# EAGLE schematic LocoNet pca9685 (EAGLE 7.5.0)
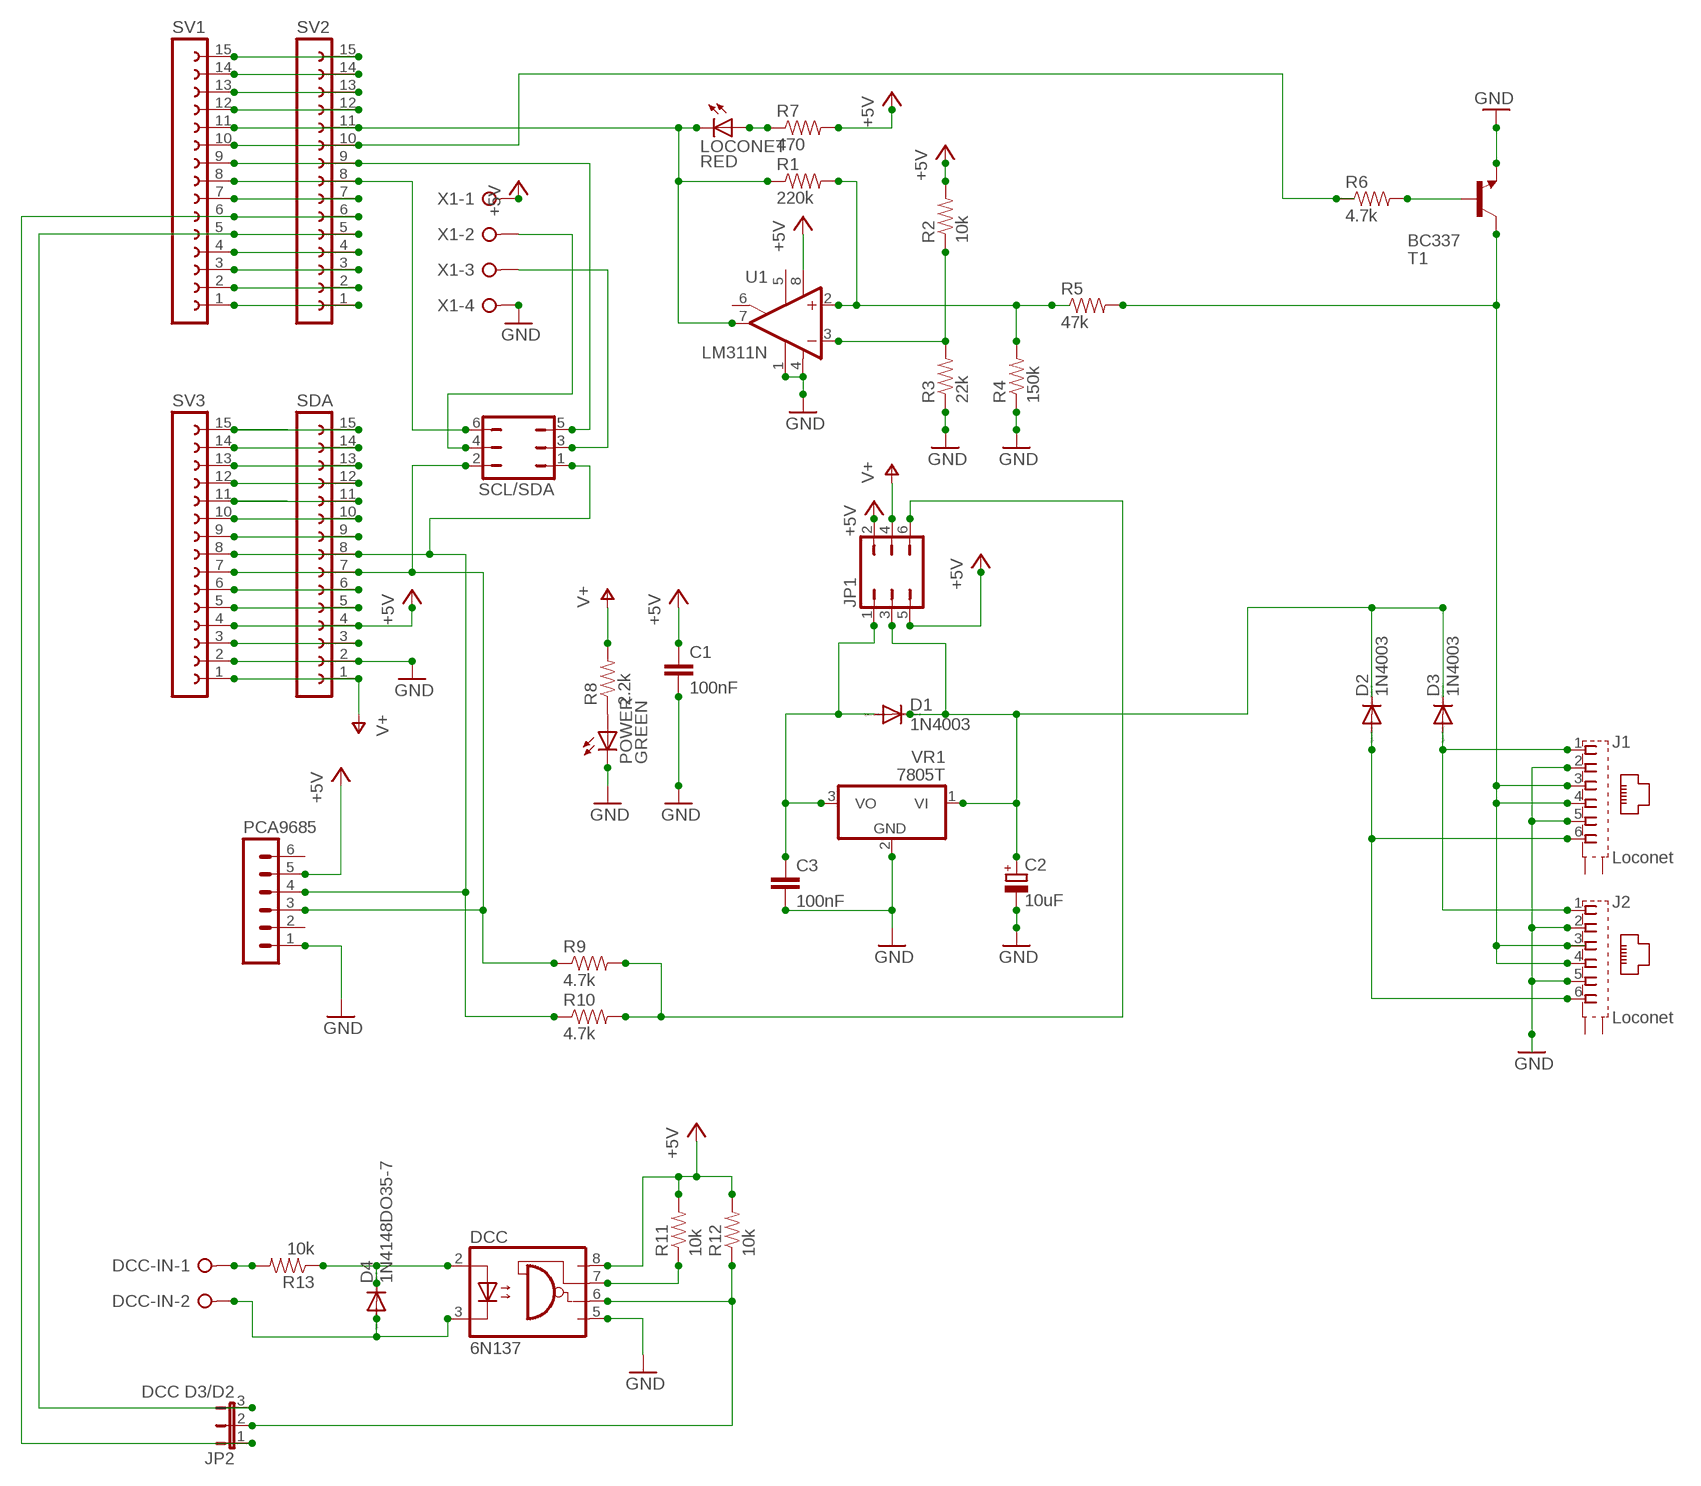
[diagram p0: schematic, sheet 1]

## Parts
C1  100nF  C-EU025_050-025X075  [C025_050-025X075]
C2  10uF  CPOL-EUE2.5-6  [E2,5-6]
C3  100nF  C-EU025_050-025X075  [C025_050-025X075]
D1  1N4003  1N4004  [DO41-10]
D2  1N4003  1N4004  [DO41-10]
D3  1N4003  1N4004  [DO41-10]
D4  1N4148DO35-7  [DO35-7]
DCC  6N137  [DIL08]
DCC-IN  W237-02P  [W237-132]
J1  Loconet  555140-1  [555140-1]
J2  Loconet  555140-1  [555140-1]
JP1  JP3Q  [JP3Q]
JP2  DCC D3/D2  JP2E  [JP2]
LOCONET  RED  LED3MM  [LED3MM]
PCA9685  MA06-1  [MA06-1]
POWER  GREEN  LED3MM  [LED3MM]
R1  220k  RESISTORAXIAL-0.3  [AXIAL-0.3]
R2  10k  RESISTORAXIAL-0.3  [AXIAL-0.3]
R3  22k  RESISTORAXIAL-0.3  [AXIAL-0.3]
R4  150k  RESISTORAXIAL-0.3  [AXIAL-0.3]
R5  47k  RESISTORAXIAL-0.3  [AXIAL-0.3]
R6  4.7k  RESISTORAXIAL-0.3  [AXIAL-0.3]
R7  470  RESISTORAXIAL-0.3  [AXIAL-0.3]
R8  2.2k  RESISTORAXIAL-0.3  [AXIAL-0.3]
R9  4.7k  RESISTORAXIAL-0.3  [AXIAL-0.3]
R10  4.7k  RESISTORAXIAL-0.3  [AXIAL-0.3]
R11  10k  RESISTORAXIAL-0.3  [AXIAL-0.3]
R12  10k  RESISTORAXIAL-0.3  [AXIAL-0.3]
R13  10k  RESISTORAXIAL-0.3  [AXIAL-0.3]
SCL/SDA  JP3Q  [JP3Q]
SDA  FE15-1NOTEXT  [FE15]
SV1  FE15-1NOTEXT  [FE15]
SV2  FE15-1NOTEXT  [FE15]
SV3  FE15-1NOTEXT  [FE15]
T1  BC337  [TO92]
U1  LM311N  [DIL08]
VR1  7805T  [TO220H]
X1  W237-04P  [W237-4P]

## Nets
+5V [5v]: C1.1 DCC.8(VCC) JP1.2 JP1.5 PCA9685.5 R2.P$2 R7.P$2 R11.P$2 R12.P$2 SDA.4 SV3.4 U1.8(V+) X1.1
ARDUINO-DCC: DCC.6(VO) JP2.2 R12.P$1
GND [ground]: C1.2 C2.- C3.2 DCC.5(GND) J1.2 J1.5 J2.2 J2.5 PCA9685.1 POWER.K(C) R3.P$1 R4.P$1 SDA.2 SV3.2 T1.1(E) U1.1(GND) U1.4(V-) VR1.2(GND) X1.4
L-RX: LOCONET.K(C) R1.P$1 SV1.11 SV2.11 U1.7(OUT)
L-TX: R6.P$1 SV1.10 SV2.10
N$1 [Vin]: D3.A J1.1 J2.1
N$2 [Vin]: D2.A J1.6 J2.6
N$3: JP1.6 R9.P$2 R10.P$2
N$4 [5v]: C3.1 D1.A JP1.1 VR1.3(VO)
N$5: POWER.A R8.P$1
N$6 [Vin]: C2.+ D1.C D2.C D3.C JP1.3 VR1.1(VI)
N$7: LOCONET.A R7.P$1
N$8: R6.P$2 T1.2(B)
N$9 [Loconet]: J1.3 J1.4 J2.3 J2.4 R5.P$2 T1.3(C)
N$10: R1.P$2 R4.P$2 R5.P$1 U1.2(+IN)
N$11: R2.P$1 R3.P$2 U1.3(-IN)
N$14: SDA.3 SV3.3
N$16: SDA.5 SV3.5
N$17: SDA.6 SV3.6
N$18: SCL/SDA.4 X1.2
N$20: SDA.9 SV3.9
N$21: SDA.10 SV3.10
N$22: SDA.11 SV3.11
N$23: SDA.12 SV3.12
N$24: SDA.13 SV3.13
N$25: SDA.14 SV3.14
N$26: SDA.15 SV3.15
N$27: SV1.1 SV2.1
N$28: SV1.2 SV2.2
N$29: SV1.3 SV2.3
N$30: SV1.4 SV2.4
N$33: SV1.7 SV2.7
N$36: SCL/SDA.3 X1.3
N$37 [DCC]: D4.C DCC.2(A) R13.P$1
N$38: SV1.12 SV2.12
N$39: SV1.13 SV2.13
N$40: SV1.14 SV2.14
N$41: SV1.15 SV2.15
N$42 [DCC]: D4.A DCC-IN.2 DCC.3(C)
N$43: DCC.7(VE) R11.P$1
N$45 [DCC]: DCC-IN.1 R13.P$2
PIN2: JP2.3 SV1.5 SV2.5
PIN3: JP2.1 SV1.6 SV2.6
PIN5: SCL/SDA.6 SV1.8 SV2.8
PIN6: SCL/SDA.5 SV1.9 SV2.9
SCL: PCA9685.3 R9.P$1 SCL/SDA.2 SDA.7 SV3.7
SDA: PCA9685.4 R10.P$1 SCL/SDA.1 SDA.8 SV3.8
V+ [Vin]: JP1.4 R8.P$2 SDA.1 SV3.1
Unconnected: J1.G1(S1) J1.G2(S2) J2.G1(S1) J2.G2(S2) PCA9685.2 PCA9685.6 U1.5(ON) U1.6(ON/STR)

## Library data of the parts
C1 C3 = rcl:C-EU: CAPACITOR, European symbol
C2 = rcl:CPOL-EU: POLARIZED CAPACITOR, European symbol
D1-D3 = diode:1N4004: DIODE general purpose rectifier, 1 A
D4 = diode:1N4148: DIODE high speed (Philips)
DCC = optocoupler:6N137: MOTOROLA OPTO COUPLER; MPN: 6N137; OC_FARNELL: 1328376; OC_NEWARK: 52M1895
DCC-IN = con-wago-508:W237-02P: WAGO SREW CLAMP; OC_FARNELL: unknown; OC_NEWARK: unknown
J1 J2 = con-amp:555140-1: AMP connector
JP1 SCL/SDA = jumper:JP3Q: JUMPER
JP2 = jumper:JP2E: JUMPER
LOCONET POWER = led:LED: LED OSRAM: - CHIPLED LG R971, LG N971, LY N971, LG Q971, LY Q971, LO R971, LY R971 LH N974, LH R974 LS Q976, LO Q976, LY Q976 LO Q996 - Hyper CHIPLED LW Q18S LB Q993, LB Q99A, LB R99A - SideLED LS A670, LO A670, LY A670, LG A670, LP A670 LB A673, LV A673, LT A673, LW A673 LH A674 LY A675 LS A676, LA A676, LO A676, LY A676, LW A676 LS A679, LY A679, LG A679 - Hyper Micro SIDELED® LS Y876, LA Y876, LO Y876, LY Y876 LT Y87S - SmartLED LW L88C, LW L88S LB L89C, LB L89S, LG L890 LS L89K, LO L89K, LY L89K LS L896, LA L896, LO L896, LY L896 - TOPLED LS T670, LO T670, LY T670, LG T670, LP T670 LSG T670, LSP T670, LSY T670, LOP T670, LYG T670 LG T671, LOG T671, LSG T671 LB T673, LV T673, LT T673, LW T673 LH T674 LS T676, LA T676, LO T676, LY T676, LB T676, LH T676, LSB T676, LW T676 LB T67C, LV T67C, LT T67C, LS T67K, LO T67K, LY T67K, LW E67C LS E67B, LA E67B, LO E67B, LY E67B, LB E67C, LV E67C, LT E67C LW T67C LS T679, LY T679, LG T679 LS T770, LO T770, LY T770, LG T770, LP T770 LB T773, LV T773, LT T773, LW T773 LH T774 LS E675, LA E675, LY E675, LS T675 LS T776, LA T776, LO T776, LY T776, LB T776 LHGB T686 LT T68C, LB T68C - Hyper Mini TOPLED® LB M676 - Mini TOPLED Santana® LG M470 LS M47K, LO M47K, LY M47K Source: http://www.osram.convergy.de LUXEON: - LUMILED® LXK2-PW12-R00, LXK2-PW12-S00, LXK2-PW14-U00, LXK2-PW14-V00 LXK2-PM12-R00, LXK2-PM12-S00, LXK2-PM14-U00 LXK2-PE12-Q00, LXK2-PE12-R00, LXK2-PE12-S00, LXK2-PE14-T00, LXK2-PE14-U00 LXK2-PB12-K00, LXK2-PB12-L00, LXK2-PB12-M00, LXK2-PB14-N00, LXK2-PB14-P00, LXK2-PB14-Q00 LXK2-PR12-L00, LXK2-PR12-M00, LXK2-PR14-Q00, LXK2-PR14-R00 LXK2-PD12-Q00, LXK2-PD12-R00, LXK2-PD12-S00 LXK2-PH12-R00, LXK2-PH12-S00 LXK2-PL12-P00, LXK2-PL12-Q00, LXK2-PL12-R00 Source: www.luxeon.com KINGBRIGHT: KA-3528ASYC Source: www.kingbright.com
PCA9685 = con-lstb:MA06-1: PIN HEADER; OC_FARNELL: unknown; OC_NEWARK: unknown
R1-R13 = SparkFun-Resistors:RESISTOR: Resistor Basic schematic elements and footprints for 0603, 1206, and PTH resistors.
SDA SV1-SV3 = con-lsta:FE15-1: FEMALE HEADER
T1 = transistor:BC337: NPN TRANSISTOR
U1 = linear:LM311: COMPARATOR
VR1 = linear:78*: Positive VOLTAGE REGULATOR Source: http://cache.national.com/ds/LM/LM78L05.pdf http://www.fairchildsemi.com/ds/LM/LM7805.pdf
X1 = con-wago-508:W237-04P: WAGO SREW CLAMP; OC_FARNELL: unknown; OC_NEWARK: unknown

## Net classes
0 default: width 0.254 mm
1 ground: width 0.61 mm
2 5v: width 0.508 mm
3 Vin: width 0.61 mm
4 Loconet: width 0.508 mm
5 DCC: width 0.508 mm